# EAGLE design DistributionBoard (EAGLE 9.2.2)

## Sheet 1 of 3
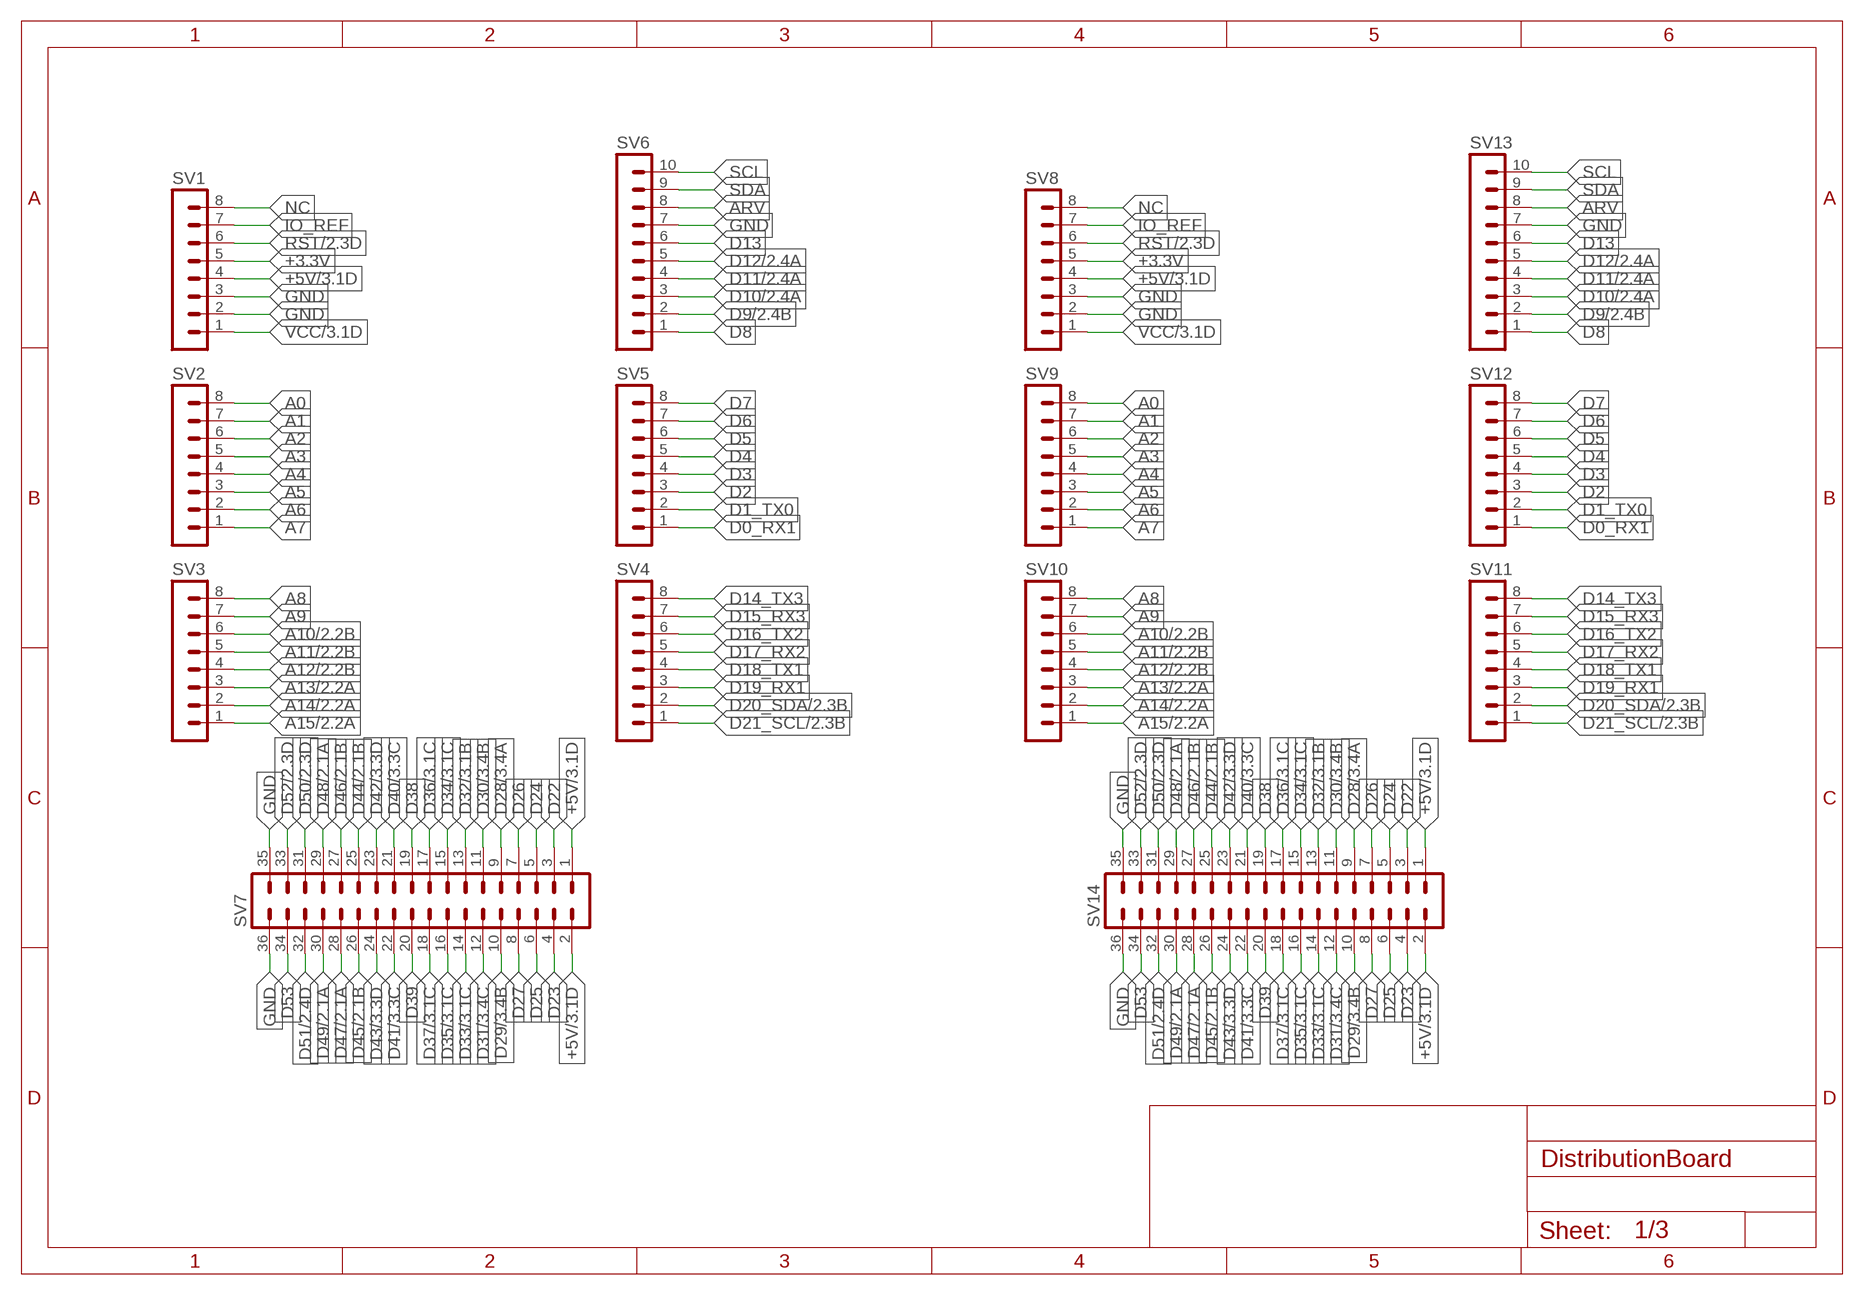
[diagram p0: schematic, sheet 1]

### Parts
SV1  MA08-1  [MA08-1]
SV2  MA08-1  [MA08-1]
SV3  MA08-1  [MA08-1]
SV4  MA08-1  [MA08-1]
SV5  MA08-1  [MA08-1]
SV6  MA10-1  [MA10-1]
SV7  MA18-2  [MA18-2]
SV8  MA08-1  [MA08-1]
SV9  MA08-1  [MA08-1]
SV10  MA08-1  [MA08-1]
SV11  MA08-1  [MA08-1]
SV12  MA08-1  [MA08-1]
SV13  MA10-1  [MA10-1]
SV14  MA18-2  [MA18-2]

### Nets
+3.3V: SV1.5 SV8.5
+5V: SV1.4 SV7.1 SV7.2 SV8.4 SV14.1 SV14.2 ; also sheet 2,3
A0: SV2.8 SV9.8
A1: SV2.7 SV9.7
A2: SV2.6 SV9.6
A3: SV2.5 SV9.5
A4: SV2.4 SV9.4
A5: SV2.3 SV9.3
A6: SV2.2 SV9.2
A7: SV2.1 SV9.1
A8: SV3.8 SV10.8
A9: SV3.7 SV10.7
A10: SV3.6 SV10.6 ; also sheet 2
A11: SV3.5 SV10.5 ; also sheet 2
A12: SV3.4 SV10.4 ; also sheet 2
A13: SV3.3 SV10.3 ; also sheet 2
A14: SV3.2 SV10.2 ; also sheet 2
A15: SV3.1 SV10.1 ; also sheet 2
ARV: SV6.8 SV13.8
D0_RX1: SV5.1 SV12.1
D1_TX0: SV5.2 SV12.2
D2: SV5.3 SV12.3
D3: SV5.4 SV12.4
D4: SV5.5 SV12.5
D5: SV5.6 SV12.6
D6: SV5.7 SV12.7
D7: SV5.8 SV12.8
D8: SV6.1 SV13.1
D9: SV6.2 SV13.2 ; also sheet 2
D10: SV6.3 SV13.3 ; also sheet 2
D11: SV6.4 SV13.4 ; also sheet 2
D12: SV6.5 SV13.5 ; also sheet 2
D13: SV6.6 SV13.6
D14_TX3: SV4.8 SV11.8
D15_RX3: SV4.7 SV11.7
D16_TX2: SV4.6 SV11.6
D17_RX2: SV4.5 SV11.5
D18_TX1: SV4.4 SV11.4
D19_RX1: SV4.3 SV11.3
D20_SDA: SV4.2 SV11.2 ; also sheet 2
D21_SCL: SV4.1 SV11.1 ; also sheet 2
D22: SV7.3 SV14.3
D23: SV7.4 SV14.4
D24: SV7.5 SV14.5
D25: SV7.6 SV14.6
D26: SV7.7 SV14.7
D27: SV7.8 SV14.8
D28: SV7.9 SV14.9 ; also sheet 3
D29: SV7.10 SV14.10 ; also sheet 3
D30: SV7.11 SV14.11 ; also sheet 3
D31: SV7.12 SV14.12 ; also sheet 3
D32: SV7.13 SV14.13 ; also sheet 3
D33: SV7.14 SV14.14 ; also sheet 3
D34: SV7.15 SV14.15 ; also sheet 3
D35: SV7.16 SV14.16 ; also sheet 3
D36: SV7.17 SV14.17 ; also sheet 3
D37: SV7.18 SV14.18 ; also sheet 3
D38: SV7.19 SV14.19
D39: SV7.20 SV14.20
D40: SV7.21 SV14.21 ; also sheet 3
D41: SV7.22 SV14.22 ; also sheet 3
D42: SV7.23 SV14.23 ; also sheet 3
D43: SV7.24 SV14.24 ; also sheet 3
D44: SV7.25 SV14.25 ; also sheet 2
D45: SV7.26 SV14.26 ; also sheet 2
D46: SV7.27 SV14.27 ; also sheet 2
D47: SV7.28 SV14.28 ; also sheet 2
D48: SV7.29 SV14.29 ; also sheet 2
D49: SV7.30 SV14.30 ; also sheet 2
D50: SV7.31 SV14.31 ; also sheet 2
D51: SV7.32 SV14.32 ; also sheet 2
D52: SV7.33 SV14.33 ; also sheet 2
D53: SV7.34 SV14.34
GND: SV1.2 SV1.3 SV6.7 SV7.35 SV7.36 SV8.2 SV8.3 SV13.7 SV14.35 SV14.36 ; also sheet 2,3
IO_REF: SV1.7 SV8.7
NC: SV1.8 SV8.8
RST: SV1.6 SV8.6 ; also sheet 2,3
SCL: SV6.10 SV13.10
SDA: SV6.9 SV13.9
VCC: SV1.1 SV8.1 ; also sheet 2,3

## Sheet 2 of 3
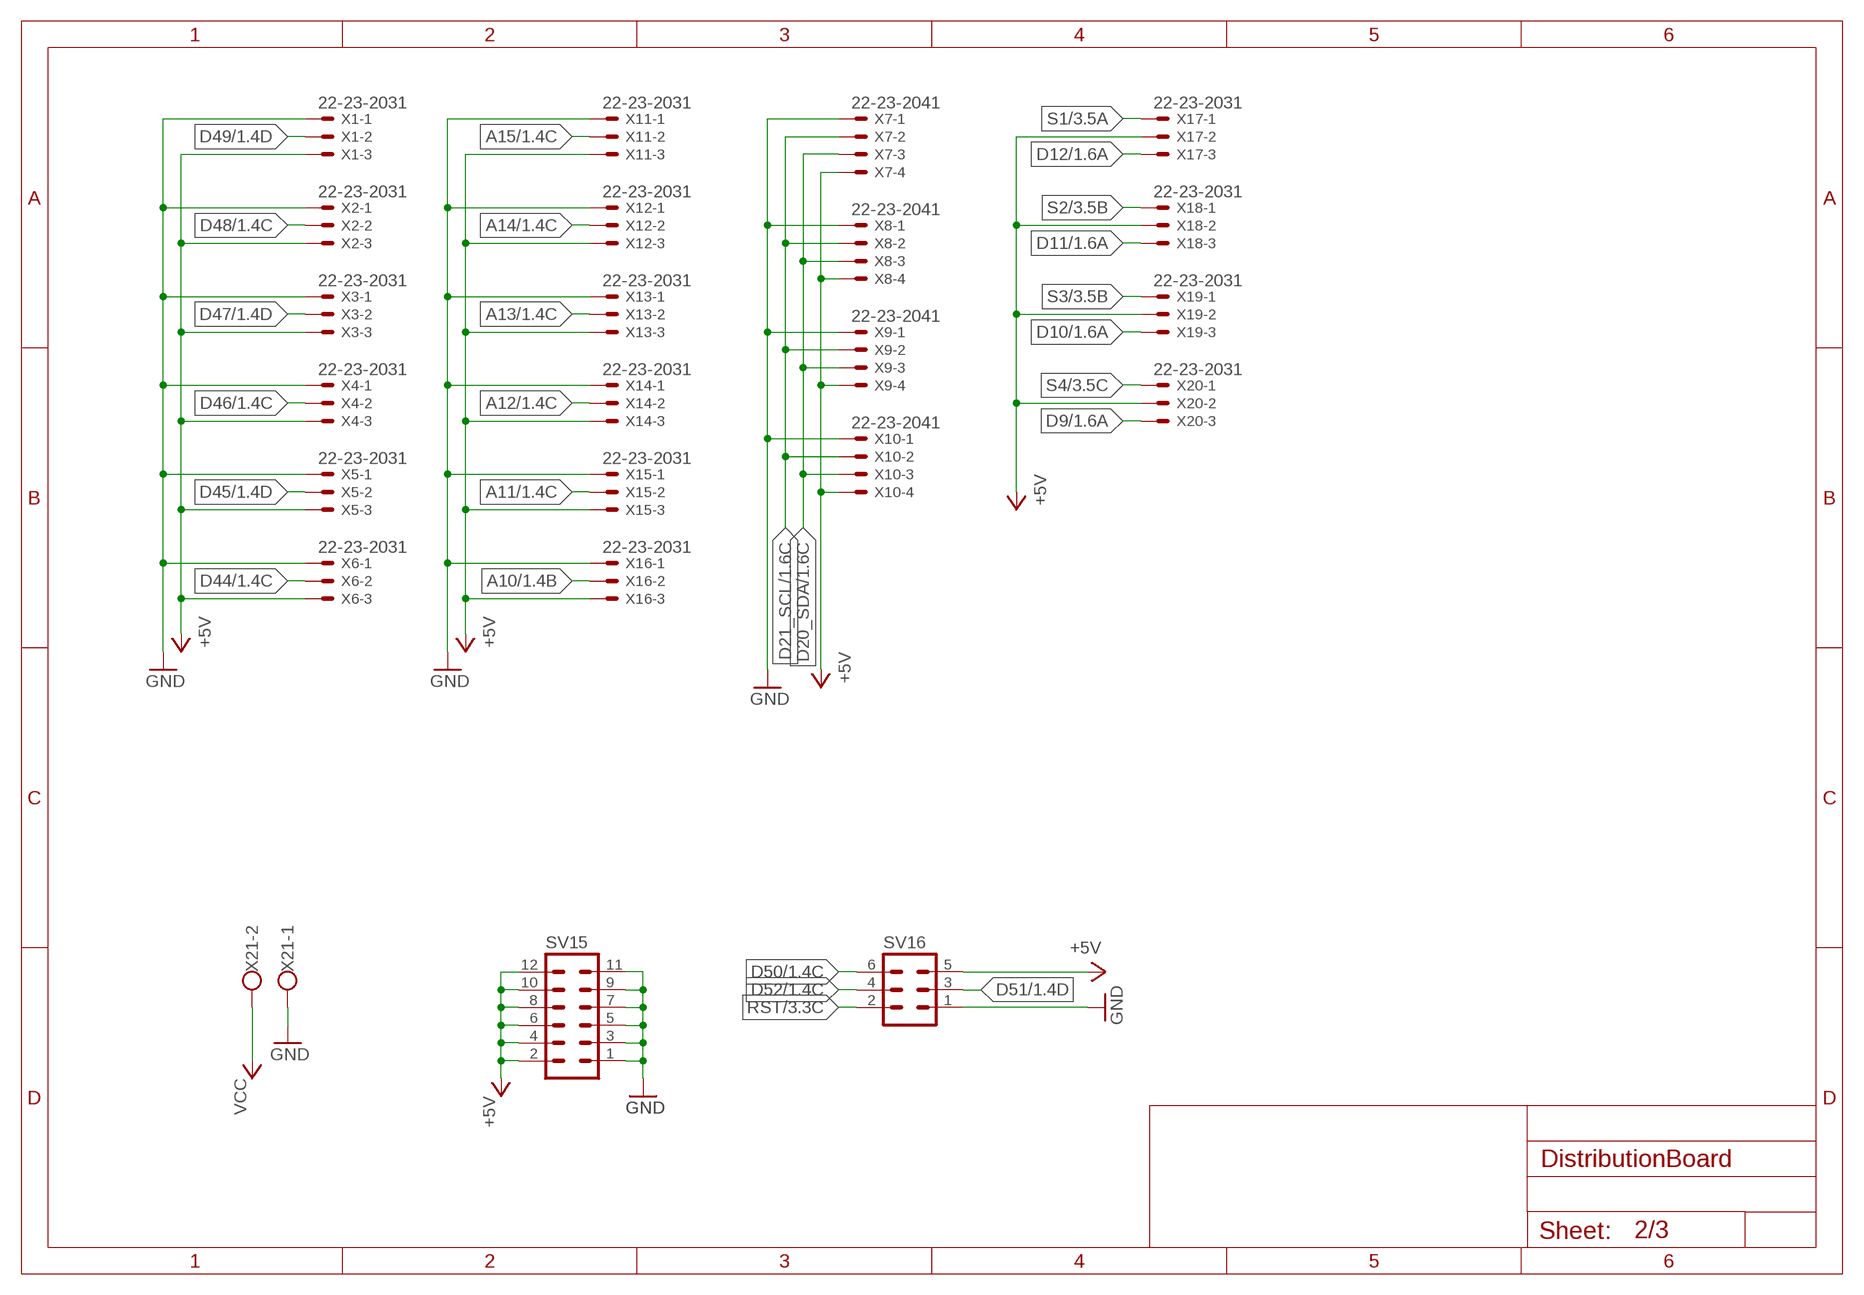
[diagram p1: schematic, sheet 2]

### Parts
SV15  MA06-2  [MA06-2]
SV16  MA03-2  [MA03-2]
X1  22-23-2031  [22-23-2031]
X2  22-23-2031  [22-23-2031]
X3  22-23-2031  [22-23-2031]
X4  22-23-2031  [22-23-2031]
X5  22-23-2031  [22-23-2031]
X6  22-23-2031  [22-23-2031]
X7  22-23-2041  [22-23-2041]
X8  22-23-2041  [22-23-2041]
X9  22-23-2041  [22-23-2041]
X10  22-23-2041  [22-23-2041]
X11  22-23-2031  [22-23-2031]
X12  22-23-2031  [22-23-2031]
X13  22-23-2031  [22-23-2031]
X14  22-23-2031  [22-23-2031]
X15  22-23-2031  [22-23-2031]
X16  22-23-2031  [22-23-2031]
X17  22-23-2031  [22-23-2031]
X18  22-23-2031  [22-23-2031]
X19  22-23-2031  [22-23-2031]
X20  22-23-2031  [22-23-2031]
X21  W237-102  [W237-102]

### Nets
+5V: SV15.2 SV15.4 SV15.6 SV15.8 SV15.10 SV15.12 SV16.5 X1.3 X2.3 X3.3 X4.3 X5.3 X6.3 X7.4 X8.4 X9.4 X10.4 X11.3 X12.3 X13.3 X14.3 X15.3 X16.3 X17.2 X18.2 X19.2 X20.2 ; also sheet 1,3
A10: X16.2 ; also sheet 1
A11: X15.2 ; also sheet 1
A12: X14.2 ; also sheet 1
A13: X13.2 ; also sheet 1
A14: X12.2 ; also sheet 1
A15: X11.2 ; also sheet 1
D9: X20.3 ; also sheet 1
D10: X19.3 ; also sheet 1
D11: X18.3 ; also sheet 1
D12: X17.3 ; also sheet 1
D20_SDA: X7.3 X8.3 X9.3 X10.3 ; also sheet 1
D21_SCL: X7.2 X8.2 X9.2 X10.2 ; also sheet 1
D44: X6.2 ; also sheet 1
D45: X5.2 ; also sheet 1
D46: X4.2 ; also sheet 1
D47: X3.2 ; also sheet 1
D48: X2.2 ; also sheet 1
D49: X1.2 ; also sheet 1
D50: SV16.6 ; also sheet 1
D51: SV16.3 ; also sheet 1
D52: SV16.4 ; also sheet 1
GND: SV15.1 SV15.3 SV15.5 SV15.7 SV15.9 SV15.11 SV16.1 X1.1 X2.1 X3.1 X4.1 X5.1 X6.1 X7.1 X8.1 X9.1 X10.1 X11.1 X12.1 X13.1 X14.1 X15.1 X16.1 X21.1 ; also sheet 1,3
RST: SV16.2 ; also sheet 1,3
S1: X17.1 ; also sheet 3
S2: X18.1 ; also sheet 3
S3: X19.1 ; also sheet 3
S4: X20.1 ; also sheet 3
VCC: X21.2 ; also sheet 1,3

## Sheet 3 of 3
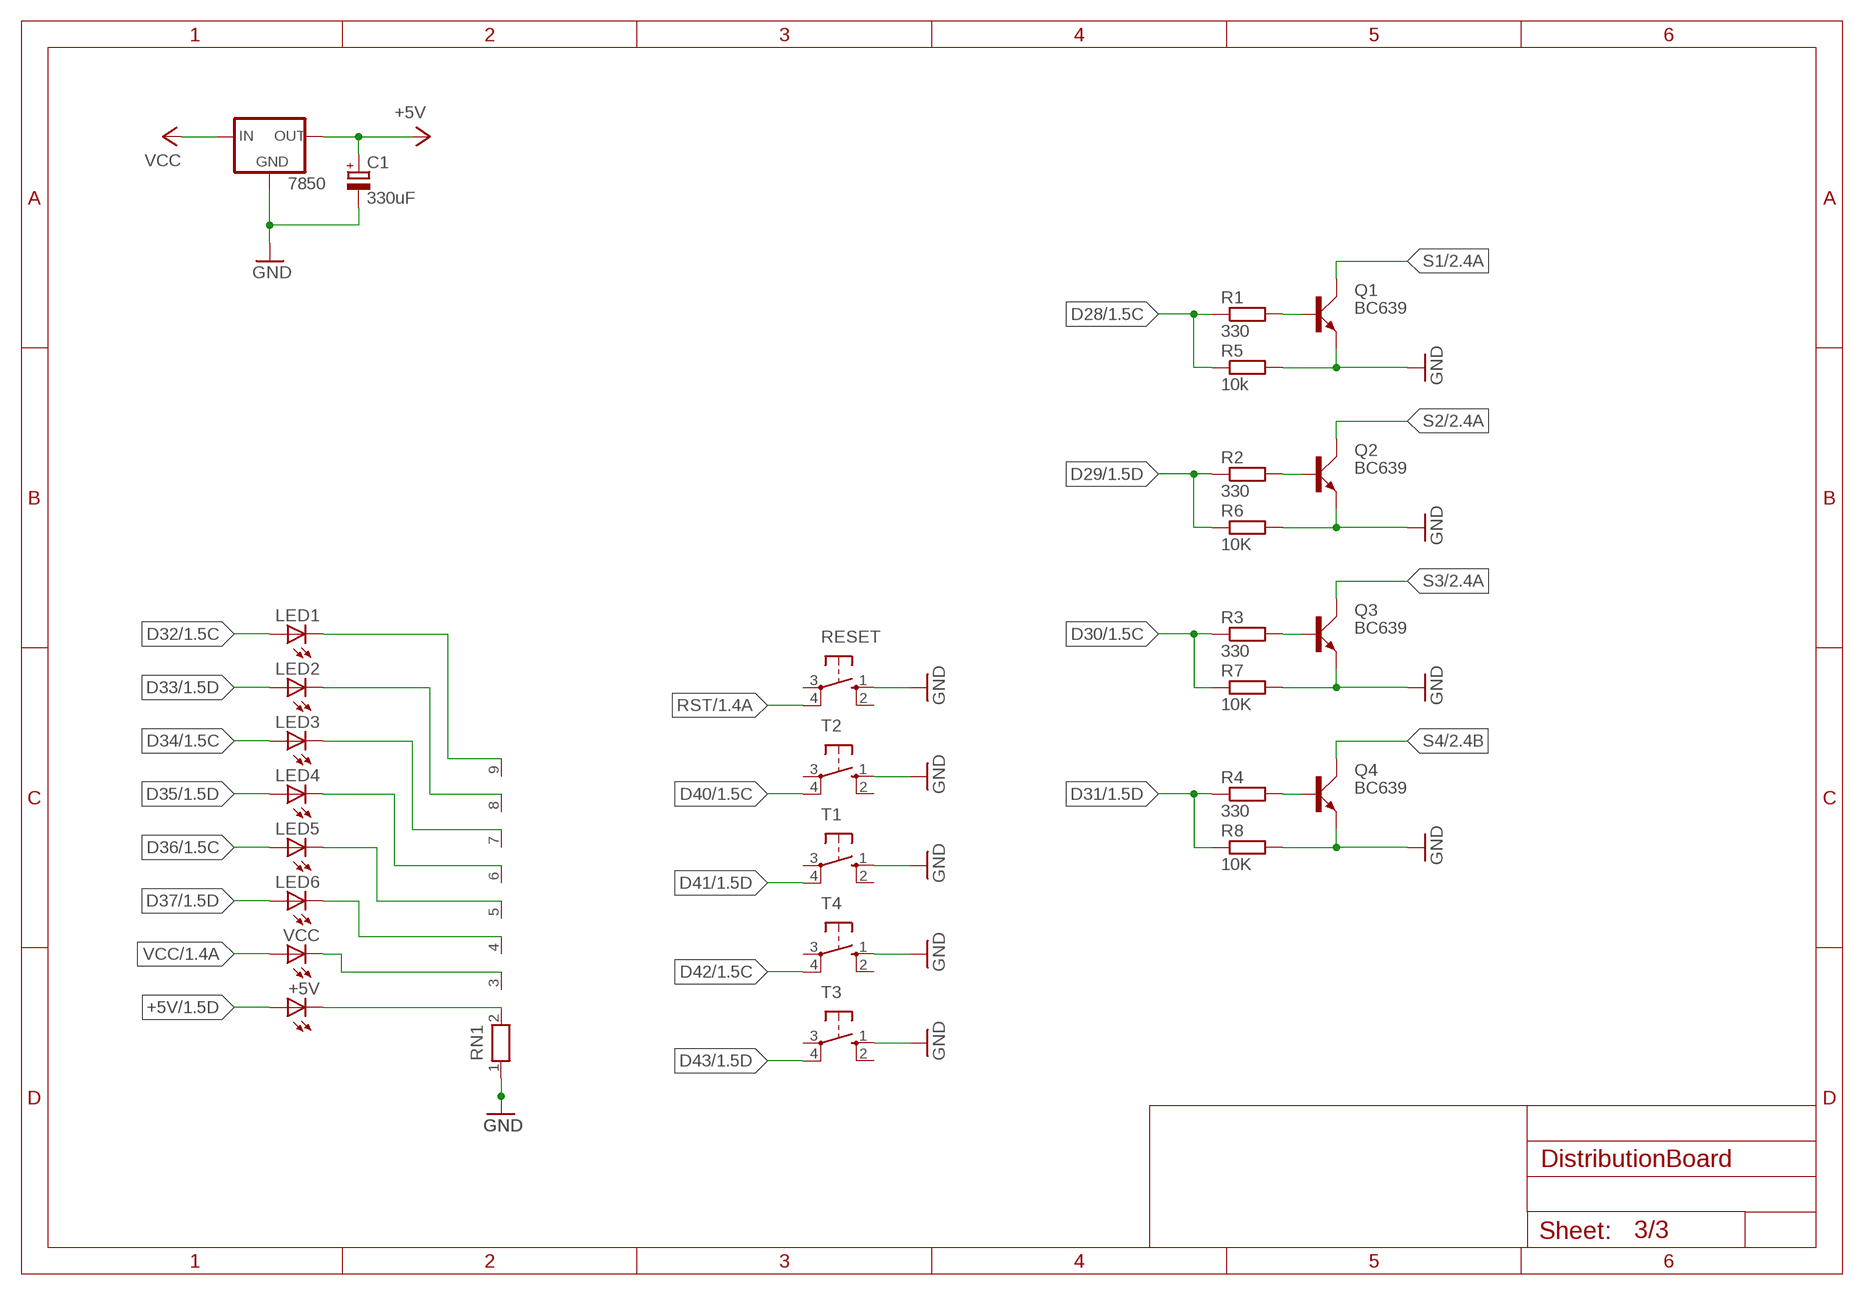
[diagram p2: schematic, sheet 3]

### Parts
7850  78XXS  [78XXS]
+5V  LED3MM  [LED3MM]
C1  330uF  CPOL-EUE3.5-8  [E3,5-8]
LED1  LED3MM  [LED3MM]
LED2  LED3MM  [LED3MM]
LED3  LED3MM  [LED3MM]
LED4  LED3MM  [LED3MM]
LED5  LED3MM  [LED3MM]
LED6  LED3MM  [LED3MM]
Q1  BC639  [SOT54D]
Q2  BC639  [SOT54D]
Q3  BC639  [SOT54D]
Q4  BC639  [SOT54D]
R1  330  R-EU_M1206  [M1206]
R2  330  R-EU_M1206  [M1206]
R3  330  R-EU_M1206  [M1206]
R4  330  R-EU_M1206  [M1206]
R5  10k  R-EU_M1206  [M1206]
R6  10K  R-EU_M1206  [M1206]
R7  10K  R-EU_M1206  [M1206]
R8  10K  R-EU_M1206  [M1206]
RESET  10-XX  [B3F-10XX]
RN1  RN08  [RN-9]
T1  10-XX  [B3F-10XX]
T2  10-XX  [B3F-10XX]
T3  10-XX  [B3F-10XX]
T4  10-XX  [B3F-10XX]
VCC  LED3MM  [LED3MM]

### Nets
+5V: 7850.OUT +5V.A C1.+ ; also sheet 1,2
D28: R1.1 R5.1 ; also sheet 1
D29: R2.1 R6.1 ; also sheet 1
D30: R3.1 R7.1 ; also sheet 1
D31: R4.1 R8.1 ; also sheet 1
D32: LED1.A ; also sheet 1
D33: LED2.A ; also sheet 1
D34: LED3.A ; also sheet 1
D35: LED4.A ; also sheet 1
D36: LED5.A ; also sheet 1
D37: LED6.A ; also sheet 1
D40: T2.4(P1) ; also sheet 1
D41: T1.4(P1) ; also sheet 1
D42: T4.4(P1) ; also sheet 1
D43: T3.4(P1) ; also sheet 1
GND: 7850.GND C1.- Q1.E Q2.E Q3.E Q4.E R5.2 R6.2 R7.2 R8.2 RESET.1(S) RN1.1 T1.1(S) T2.1(S) T3.1(S) T4.1(S) ; also sheet 1,2
N$1: +5V.K(C) RN1.2
N$2: RN1.3 VCC.K(C)
N$3: LED6.K(C) RN1.4
N$4: LED5.K(C) RN1.5
N$5: LED4.K(C) RN1.6
N$6: LED3.K(C) RN1.7
N$7: LED2.K(C) RN1.8
N$8: LED1.K(C) RN1.9
N$9: Q4.B R4.2
N$10: Q3.B R3.2
N$11: Q2.B R2.2
N$12: Q1.B R1.2
RST: RESET.4(P1) ; also sheet 1,2
S1: Q1.C ; also sheet 2
S2: Q2.C ; also sheet 2
S3: Q3.C ; also sheet 2
S4: Q4.C ; also sheet 2
VCC: 7850.IN VCC.A ; also sheet 1,2
Unconnected: RESET.2(S1) RESET.3(P) T1.2(S1) T1.3(P) T2.2(S1) T2.3(P) T3.2(S1) T3.3(P) T4.2(S1) T4.3(P)

## Library data of the parts
7850 = v-reg:78XXS: VOLTAGE REGULATOR
+5V LED1-LED6 VCC = led:LED: LED OSRAM: - CHIPLED LG R971, LG N971, LY N971, LG Q971, LY Q971, LO R971, LY R971 LH N974, LH R974 LS Q976, LO Q976, LY Q976 LO Q996 - Hyper CHIPLED LW Q18S LB Q993, LB Q99A, LB R99A - SideLED LS A670, LO A670, LY A670, LG A670, LP A670 LB A673, LV A673, LT A673, LW A673 LH A674 LY A675 LS A676, LA A676, LO A676, LY A676, LW A676 LS A679, LY A679, LG A679 - Hyper Micro SIDELED® LS Y876, LA Y876, LO Y876, LY Y876 LT Y87S - SmartLED LW L88C, LW L88S LB L89C, LB L89S, LG L890 LS L89K, LO L89K, LY L89K LS L896, LA L896, LO L896, LY L896 - TOPLED LS T670, LO T670, LY T670, LG T670, LP T670 LSG T670, LSP T670, LSY T670, LOP T670, LYG T670 LG T671, LOG T671, LSG T671 LB T673, LV T673, LT T673, LW T673 LH T674 LS T676, LA T676, LO T676, LY T676, LB T676, LH T676, LSB T676, LW T676 LB T67C, LV T67C, LT T67C, LS T67K, LO T67K, LY T67K, LW E67C LS E67B, LA E67B, LO E67B, LY E67B, LB E67C, LV E67C, LT E67C LW T67C LS T679, LY T679, LG T679 LS T770, LO T770, LY T770, LG T770, LP T770 LB T773, LV T773, LT T773, LW T773 LH T774 LS E675, LA E675, LY E675, LS T675 LS T776, LA T776, LO T776, LY T776, LB T776 LHGB T686 LT T68C, LB T68C - Hyper Mini TOPLED® LB M676 - Mini TOPLED Santana® LG M470 LS M47K, LO M47K, LY M47K Source: http://www.osram.convergy.de LUXEON: - LUMILED® LXK2-PW12-R00, LXK2-PW12-S00, LXK2-PW14-U00, LXK2-PW14-V00 LXK2-PM12-R00, LXK2-PM12-S00, LXK2-PM14-U00 LXK2-PE12-Q00, LXK2-PE12-R00, LXK2-PE12-S00, LXK2-PE14-T00, LXK2-PE14-U00 LXK2-PB12-K00, LXK2-PB12-L00, LXK2-PB12-M00, LXK2-PB14-N00, LXK2-PB14-P00, LXK2-PB14-Q00 LXK2-PR12-L00, LXK2-PR12-M00, LXK2-PR14-Q00, LXK2-PR14-R00 LXK2-PD12-Q00, LXK2-PD12-R00, LXK2-PD12-S00 LXK2-PH12-R00, LXK2-PH12-S00 LXK2-PL12-P00, LXK2-PL12-Q00, LXK2-PL12-R00 Source: www.luxeon.com KINGBRIGHT: KA-3528ASYC Source: www.kingbright.com
C1 = rcl:CPOL-EU: POLARIZED CAPACITOR, European symbol; SPICEPREFIX: C
Q1-Q4 = transistor-small-signal:BC639: NPN TRANSISTOR
R1-R8 = rcl:R-EU_: RESISTOR, European symbol; SPICEPREFIX: R
RESET T1-T4 = switch-omron:10-XX: OMRON SWITCH; MPN: B3F-1000; OC_FARNELL: 176432; OC_NEWARK: 36M3542
RN1 = resistor-net:RN08: RESISTOR NETWORK; OC_FARNELL: unknown; OC_NEWARK: unknown
SV1-SV5 SV8-SV12 = con-lstb:MA08-1: PIN HEADER; OC_FARNELL: unknown; OC_NEWARK: unknown
SV6 SV13 = con-lstb:MA10-1: PIN HEADER; OC_FARNELL: unknown; OC_NEWARK: unknown
SV7 SV14 = con-lstb:MA18-2: PIN HEADER; OC_FARNELL: unknown; OC_NEWARK: unknown
SV15 = con-lstb:MA06-2: PIN HEADER; OC_FARNELL: unknown; OC_NEWARK: unknown
SV16 = con-lstb:MA03-2: PIN HEADER; OC_FARNELL: unknown; OC_NEWARK: unknown
X1-X6 X11-X20 = con-molex:22-23-2031: .100" (2.54mm) Center Header - 3 Pin; MF: MOLEX; MPN: 22-23-2031; OC_FARNELL: 1462950; OC_NEWARK: 30C0862
X7-X10 = con-molex:22-23-2041: .100" (2.54mm) Center Header - 4 Pin; MF: MOLEX; MPN: 22-23-2041; OC_FARNELL: 1462920; OC_NEWARK: 38C0355
X21 = con-wago-500:W237-102: WAGO SCREW CLAMP; MPN: 237-102; OC_FARNELL: unknown; OC_NEWARK: 70K9898

## Board
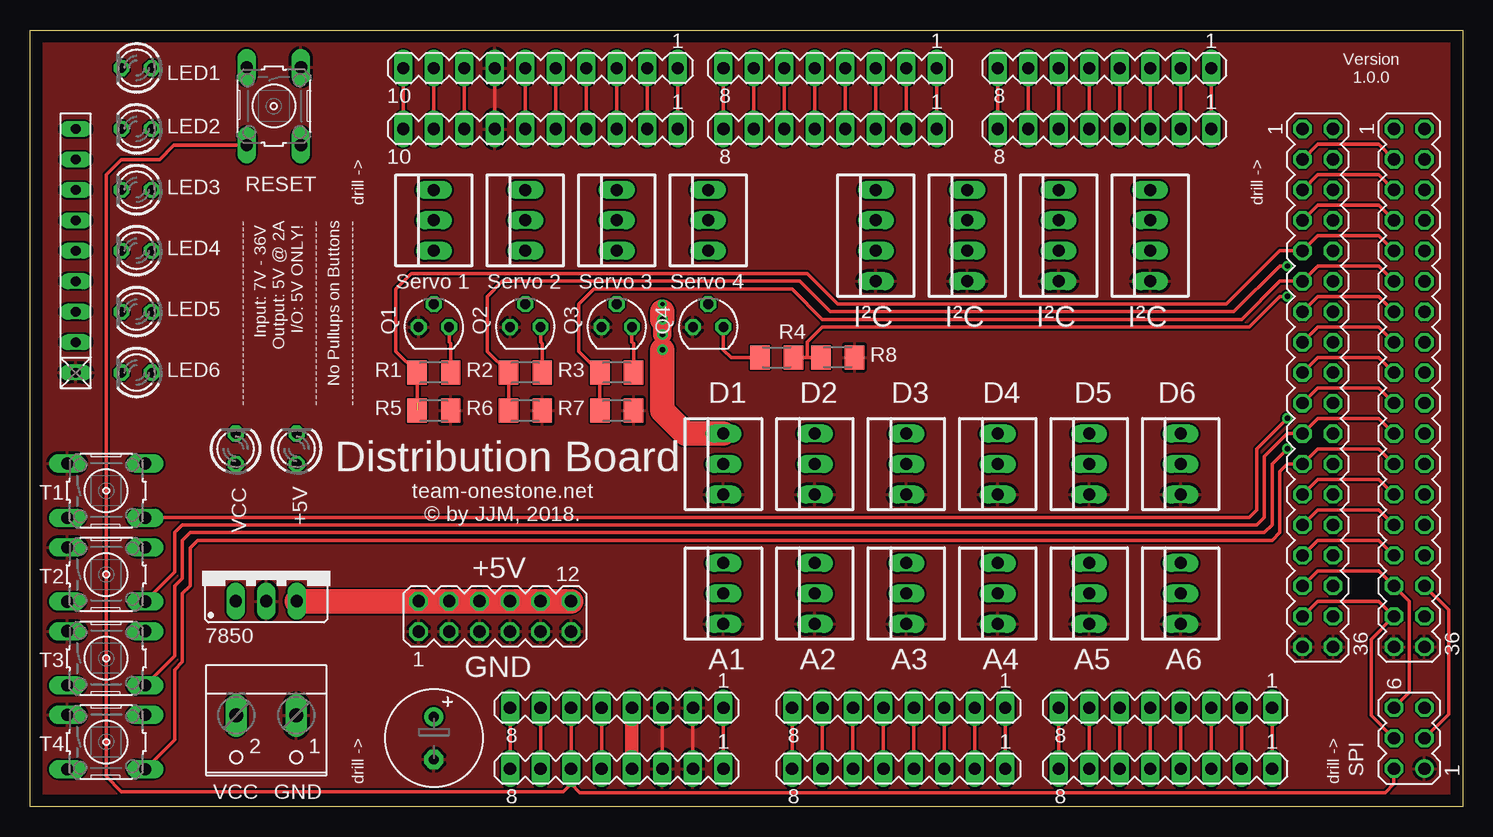
[diagram p3: board, top side]
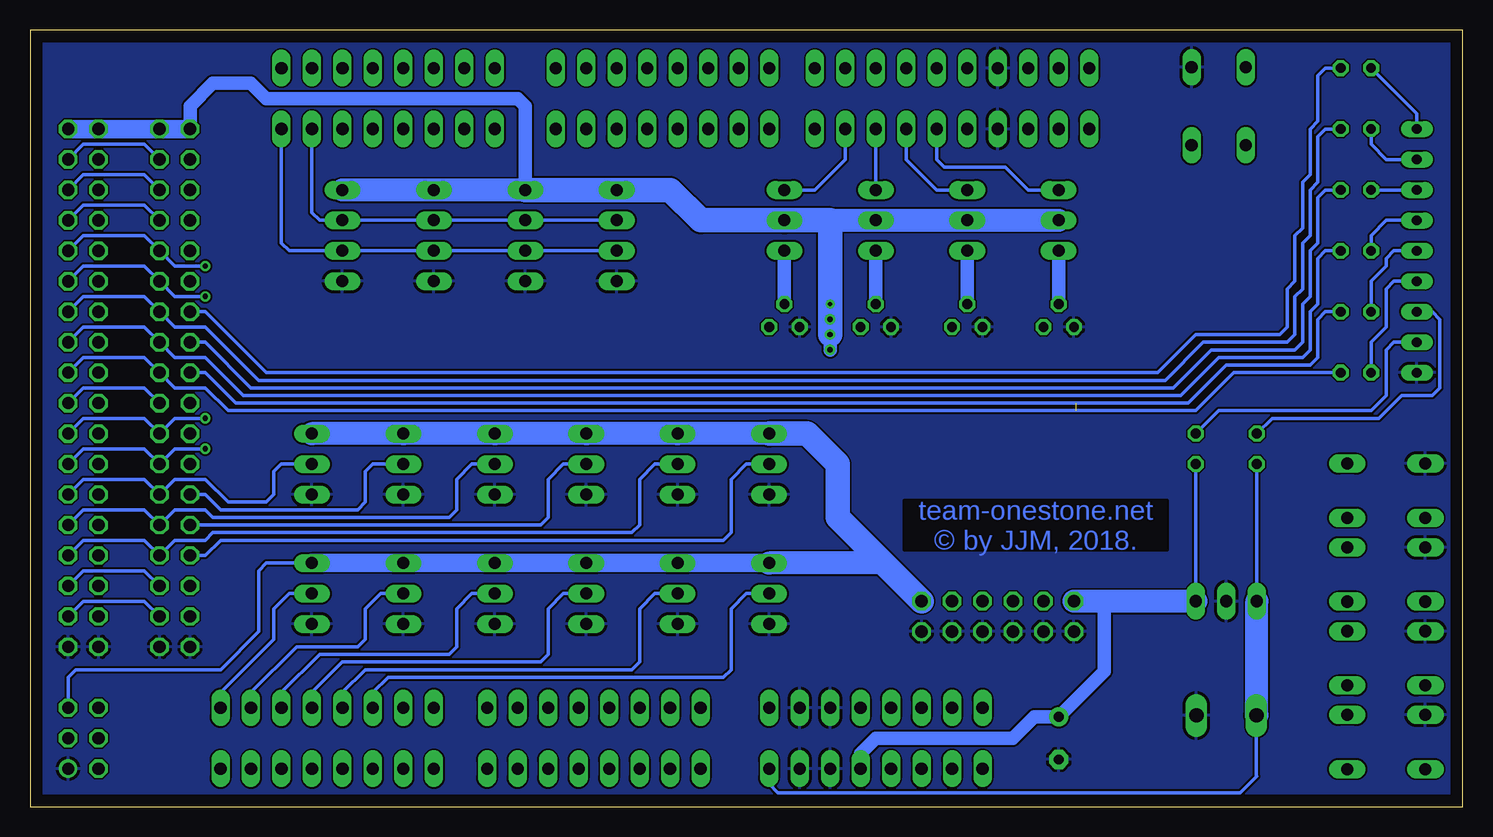
[diagram p4: board, bottom side, seen from below]

Size 119.38 x 64.77 mm. Coordinates in mm from the lower left corner, seen from the top.
Outline: 0,0 0,64.77 119.38,64.77 119.38,0 0,0
Copper layers (1*16): Top 0.035mm / dielectric 1.5mm / Bottom 0.035mm
Design rules "default": minimum track width 6mil, minimum drill 0.35mm, track to track 6mil, track to pad 6mil, pad to pad 6mil, via to via 6mil, smd to smd 6mil, copper to edge 40mil, drill to drill 6mil, minimum pad ring 10mil, minimum via ring 8mil, stop-mask expansion 4mil, vias tented up to drill 0mil, thermal gap 10mil

### Footprints (pad centres in the part's own frame; a part is rotated, then mirrored left to right if it is on the bottom)
78XXS = drill 1.016 long: GND 0,-2.54; IN -2.54,-2.54; OUT 2.54,-2.54
LED3MM = drill 0.813 octagon: A -1.27,0; K 1.27,0
E3,5-8 = drill 0.813 pad 1.6: + -1.778,0 | drill 0.813 pad 1.6 octagon: - 1.778,0
SOT54D = drill 0.813 octagon: B 1.27,0; C 0,1.905; E -1.27,0
M1206 = smd 1.6 x 2: 1 -1.4,0; 2 1.4,0
B3F-10XX = drill 1.016 long: 1 -3.251,2.261; 2 3.251,2.261; 3 -3.251,-2.261; 4 3.251,-2.261
RN-9 = drill 0.813 long: 1 -10.16,0; 2 -7.62,0; 3 -5.08,0; 4 -2.54,0; 5 0,0; 6 2.54,0; 7 5.08,0; 8 7.62,0; 9 10.16,0
MA08-1 = drill 1.016 long: 1 -8.89,0; 2 -6.35,0; 3 -3.81,0; 4 -1.27,0; 5 1.27,0; 6 3.81,0; 7 6.35,0; 8 8.89,0
MA10-1 = drill 1.016 long: 1 -11.43,0; 2 -8.89,0; 3 -6.35,0; 4 -3.81,0; 5 -1.27,0; 6 1.27,0; 7 3.81,0; 8 6.35,0; 9 8.89,0; 10 11.43,0
MA18-2 = drill 1.016 octagon: 1 -21.59,-1.27; 2 -21.59,1.27; 3 -19.05,-1.27; 4 -19.05,1.27; 5 -16.51,-1.27; 6 -16.51,1.27; 7 -13.97,-1.27; 8 -13.97,1.27; 9 -11.43,-1.27; 10 -11.43,1.27; 11 -8.89,-1.27; 12 -8.89,1.27; 13 -6.35,-1.27; 14 -6.35,1.27; 15 -3.81,-1.27; 16 -3.81,1.27; 17 -1.27,-1.27; 18 -1.27,1.27; 19 1.27,-1.27; 20 1.27,1.27; 21 3.81,-1.27; 22 3.81,1.27; 23 6.35,-1.27; 24 6.35,1.27; 25 8.89,-1.27; 26 8.89,1.27; 27 11.43,-1.27; 28 11.43,1.27; 29 13.97,-1.27; 30 13.97,1.27; 31 16.51,-1.27; 32 16.51,1.27; 33 19.05,-1.27; 34 19.05,1.27; 35 21.59,-1.27; 36 21.59,1.27
MA06-2 = drill 1.016 octagon: 1 -6.35,-1.27; 2 -6.35,1.27; 3 -3.81,-1.27; 4 -3.81,1.27; 5 -1.27,-1.27; 6 -1.27,1.27; 7 1.27,-1.27; 8 1.27,1.27; 9 3.81,-1.27; 10 3.81,1.27; 11 6.35,-1.27; 12 6.35,1.27
MA03-2 = drill 1.016: 1 -2.54,-1.27 | drill 1.016 octagon: 2 -2.54,1.27; 3 0,-1.27; 4 0,1.27; 5 2.54,-1.27; 6 2.54,1.27
22-23-2031 = drill 1 long: 1 -2.54,0; 2 0,0; 3 2.54,0
22-23-2041 = drill 1 long: 1 -3.81,0; 2 -1.27,0; 3 1.27,0; 4 3.81,0
W237-102 = drill 1.194 long: 1 -2.5,-1.27; 2 2.5,-1.27

### Placement (x,y rotation side)
7850  19.68,19.68 0 top
+5V  22.23,29.84 90 top
C1  33.66,5.71 270 top
LED1  8.89,61.59 180 top
LED2  8.89,56.52 180 top
LED3  8.89,51.44 180 top
LED4  8.89,46.35 180 top
LED5  8.89,41.27 180 top
LED6  8.89,36.2 180 top
Q1  33.66,40.01 0 top
Q2  41.27,40.01 0 top
Q3  48.9,40.01 0 top
Q4  56.52,40.01 0 top
R1  33.66,36.2 0 top
R2  41.27,36.2 0 top
R3  48.9,36.2 0 top
R4  62.23,37.47 180 top
R5  33.66,33.02 0 top
R6  41.27,33.02 0 top
R7  48.9,33.02 0 top
R8  67.31,37.47 0 top
RESET  20.32,58.42 270 top
RN1  3.81,46.35 90 top
SV1  48.9,8.26 180 top
SV2  72.39,8.26 180 top
SV3  94.61,8.26 180 top
SV4  89.53,56.52 180 top
SV5  66.67,56.52 180 top
SV6  42.55,56.52 180 top
SV7  107.31,34.92 270 top
SV8  48.9,3.17 180 top
SV9  72.39,3.17 180 top
SV10  94.61,3.17 180 top
SV11  89.53,61.59 180 top
SV12  66.67,61.59 180 top
SV13  42.55,61.59 180 top
SV14  114.94,34.92 270 top
SV15  38.73,15.88 0 top
SV16  114.94,5.71 90 top
T1  6.35,26.35 0 top
T2  6.35,19.37 0 top
T3  6.35,12.38 0 top
T4  6.35,5.4 0 top
VCC  17.14,29.84 90 top
X1  65.41,28.57 90 top
X2  57.78,28.57 90 top
X3  80.64,28.57 90 top
X4  73.03,28.57 90 top
X5  95.89,28.57 90 top
X6  88.27,28.57 90 top
X7  93.34,47.62 90 top
X8  85.72,47.62 90 top
X9  78.11,47.62 90 top
X10  70.48,47.62 90 top
X11  95.89,17.78 90 top
X12  88.27,17.78 90 top
X13  80.64,17.78 90 top
X14  73.03,17.78 90 top
X15  65.41,17.78 90 top
X16  57.78,17.78 90 top
X17  33.66,48.9 90 top
X18  41.27,48.9 90 top
X19  48.9,48.9 90 top
X20  56.52,48.9 90 top
X21  19.68,6.35 180 top

### Tracks (layer width: path | path; a pad name or v marks a point on that pad's centre or on a via)
+3.3V
  Top 0.305: SV1.5 SV8.5
+5V  (via drill 0.35, 0.45)
  Top 1.143: SV1.4 SV8.4
  Top 1.524: v52.7,39.37 v52.7,40.64
  Top 2.032: 7850.OUT SV15.2 SV15.4 SV15.6 SV15.8 SV15.10 SV15.12 | X2.3 54.61,31.11 52.7,33.02 v52.7,38.1 | v52.7,40.64 52.7,41.27
  Bottom 0.305: +5V.A 7850.OUT | SV16.5 116.2,10.79 115.57,11.43 103.5,11.43 100.33,14.61 100.33,19.68 99.69,20.32 X11.3
  Bottom 1.143: X9.4 78.11,58.42 78.74,59.05 99.69,59.05 100.97,60.33 104.14,60.33 106.05,58.42 SV7.1 | 29.84,17.14 29.84,11.3 C1.+ 35.69,7.49 37.47,5.71 48.9,5.71 50.16,4.45 SV8.4 | v52.7,39.37 v52.7,38.1
  Bottom 1.524: X16.3 X15.3 X14.3 X13.3 X12.3 X11.3 | SV7.1 SV7.2 SV14.1 SV14.2
  Bottom 1.905: 48.26,20.32 X16.3 | X2.3 X1.3 X4.3 X3.3 X6.3 X5.3 | X9.4 X8.4 X7.4 | 52.7,48.9 X19.2 X18.2 X17.2 | 7850.OUT 29.84,17.14 SV15.2
  Bottom 2.032: SV15.12 48.26,20.32 52.07,24.13 52.07,28.57 54.61,31.11 X2.3 | v52.7,39.37 52.7,40.31 | v52.7,40.64 v52.7,41.91 52.7,48.9 X20.2 63.5,48.9 66.04,51.44 X10.4 X9.4
A0
  Top 0.305: SV2.8 SV9.8
A1
  Top 0.305: SV2.7 SV9.7
A2
  Top 0.305: SV2.6 SV9.6
A3
  Top 0.305: SV2.5 SV9.5
A4
  Top 0.305: SV2.4 SV9.4
A5
  Top 0.305: SV2.3 SV9.3
A6
  Top 0.305: SV2.2 SV9.2
A7
  Top 0.305: SV2.1 SV9.1
A8
  Top 0.305: SV3.8 SV10.8
A9
  Top 0.305: SV3.7 SV10.7
A10
  Top 0.305: SV3.6 SV10.6
  Bottom 0.305: X16.2 59.69,17.78 60.96,16.51 60.96,11.43 61.59,10.79 89.53,10.79 90.81,9.53 SV3.6
A11
  Top 0.305: SV3.5 SV10.5
  Bottom 0.305: X15.2 67.31,17.78 68.58,16.51 68.58,12.06 69.22,11.43 91.44,11.43 93.34,9.53 SV3.5
A12
  Top 0.305: SV3.4 SV10.4
  Bottom 0.305: X14.2 74.93,17.78 76.2,16.51 76.2,12.7 76.83,12.06 93.34,12.06 95.89,9.53 SV3.4
A13
  Top 0.305: SV3.3 SV10.3
  Bottom 0.305: X13.2 82.55,17.78 83.82,16.51 83.82,13.34 84.45,12.7 95.25,12.7 98.42,9.53 SV3.3
A14
  Top 0.305: SV3.2 SV10.2
  Bottom 0.305: X12.2 90.17,17.78 91.44,16.51 91.44,13.97 92.08,13.34 97.16,13.34 100.97,9.53 SV3.2
A15
  Top 0.305: SV3.1 SV10.1
  Bottom 0.305: X11.2 97.79,17.78 99.06,16.51 99.06,13.97 103.5,9.53 SV3.1
ARV
  Top 0.305: SV6.8 SV13.8
D0_RX1
  Top 0.305: SV5.1 SV12.1
D1_TX0
  Top 0.305: SV5.2 SV12.2
D2
  Top 0.305: SV5.3 SV12.3
D3
  Top 0.305: SV5.4 SV12.4
D4
  Top 0.305: SV5.5 SV12.5
D5
  Top 0.305: SV5.6 SV12.6
D6
  Top 0.305: SV5.7 SV12.7
D7
  Top 0.305: SV5.8 SV12.8
D8
  Top 0.305: SV6.1 SV13.1
D9
  Top 0.305: SV6.2 SV13.2
  Bottom 0.305: X20.3 53.98,51.44 51.44,53.98 SV6.2
D10
  Top 0.305: SV6.3 SV13.3
  Bottom 0.305: X19.3 SV6.3
D11
  Top 0.305: SV6.4 SV13.4
  Bottom 0.305: X18.3 43.81,51.44 46.35,53.98 SV6.4
D12
  Top 0.305: SV6.5 SV13.5
  Bottom 0.305: X17.3 36.2,51.44 38.1,53.34 43.18,53.34 43.81,53.98 SV6.5
D13
  Top 0.305: SV6.6 SV13.6
D14_TX3
  Top 0.305: SV4.8 SV11.8
D15_RX3
  Top 0.305: SV4.7 SV11.7
D16_TX2
  Top 0.305: SV4.6 SV11.6
D17_RX2
  Top 0.305: SV4.5 SV11.5
D18_TX1
  Top 0.305: SV4.4 SV11.4
D19_RX1
  Top 0.305: SV4.3 SV11.3
D20_SDA
  Top 0.305: SV4.2 SV11.2
  Bottom 0.305: X10.3 X9.3 X8.3 X7.3 95.25,48.9 95.89,49.53 SV4.2
D21_SCL
  Top 0.305: SV4.1 SV11.1
  Bottom 0.305: X10.2 X9.2 X8.2 X7.2 97.79,46.35 98.42,46.99 SV4.1
D22
  Top 0.305: SV7.3 107.31,55.24 112.39,55.24 SV14.3
D23
  Bottom 0.305: SV7.4 109.86,55.24 114.94,55.24 SV14.4
D24
  Top 0.305: SV7.5 107.31,52.7 112.39,52.7 SV14.5
D25
  Bottom 0.305: SV7.6 109.86,52.7 114.94,52.7 SV14.6
D26
  Top 0.305: SV7.7 107.31,50.16 112.39,50.16 SV14.7
D27
  Bottom 0.305: SV7.8 109.86,50.16 114.94,50.16 SV14.8
D28  (1 unrouted)
  Top 0.305: SV14.9 112.39,47.62 107.31,47.62 SV7.9 104.14,46.35 99.69,41.91 67.31,41.91 64.77,44.45 31.75,44.45 30.48,43.18 30.48,37.97 R1.1 32.26,33.66
D29  (via drill 0.45)
  Top 0.305: R6.1 R2.1 38.1,37.97 38.1,42.55 39.37,43.81 64.14,43.81 66.67,41.27 100.33,41.27 104.14,45.09 v104.78,45.09
  Bottom 0.305: SV14.10 114.94,47.62 109.86,47.62 SV7.10 107.31,45.09 v104.78,45.09
D30
  Top 0.305: SV14.11 112.39,45.09 107.31,45.09 SV7.11 104.14,43.81 100.97,40.64 66.04,40.64 63.5,43.18 46.99,43.18 45.72,41.91 45.72,37.97 R3.1 R7.1
D31  (via drill 0.45)
  Top 0.305: R4.1 64.77,37.47 | 64.77,37.47 R8.1 | v104.78,42.55 104.14,42.55 101.6,40.01 66.04,40.01 64.77,38.73 64.77,37.47
  Bottom 0.305: SV14.12 114.94,45.09 109.86,45.09 SV7.12 107.31,42.55 v104.78,42.55
D32
  Top 0.305: SV7.13 107.31,42.55 112.39,42.55 SV14.13
  Bottom 0.305: SV7.13 104.78,41.27 99.69,36.2 25.4,36.2 22.23,39.37 15.24,39.37 14.61,40.01 14.61,43.18 13.97,43.81 13.97,47.62 13.34,48.26 13.34,52.07 12.7,52.7 12.7,56.52 12.06,57.15 12.06,60.96 11.43,61.59 LED1.A
D33
  Bottom 0.305: SV14.14 114.94,42.55 109.86,42.55 SV7.14 107.31,40.01 104.78,40.01 100.33,35.56 24.77,35.56 21.59,38.73 14.61,38.73 13.97,39.37 13.97,42.55 13.34,43.18 13.34,46.99 12.7,47.62 12.7,51.44 12.06,52.07 12.06,55.88 11.43,56.52 LED2.A
D34
  Top 0.305: SV7.15 107.31,40.01 112.39,40.01 SV14.15
  Bottom 0.305: SV7.15 104.78,38.73 100.97,34.92 24.13,34.92 20.95,38.1 13.97,38.1 13.34,38.73 13.34,41.91 12.7,42.55 12.7,46.35 12.06,46.99 12.06,50.8 11.43,51.44 LED3.A
D35
  Bottom 0.305: SV14.16 114.94,40.01 109.86,40.01 SV7.16 107.31,37.47 104.78,37.47 101.6,34.29 23.5,34.29 20.32,37.47 13.34,37.47 12.7,38.1 12.7,41.27 12.06,41.91 12.06,45.72 11.43,46.35 LED4.A
D36
  Top 0.305: SV7.17 107.31,37.47 112.39,37.47 SV14.17
  Bottom 0.305: SV7.17 104.78,36.2 102.23,33.66 22.86,33.66 19.68,36.83 12.7,36.83 12.06,37.47 12.06,40.64 11.43,41.27 LED5.A
D37
  Bottom 0.305: SV14.18 114.94,37.47 109.86,37.47 SV7.18 107.31,34.92 104.78,34.92 102.87,33.02 22.23,33.02 19.05,36.2 LED6.A
D38
  Top 0.305: SV7.19 107.31,34.92 112.39,34.92 SV14.19
D39
  Bottom 0.305: SV7.20 109.86,34.92 114.94,34.92 SV14.20
D40
  Top 0.305: SV14.21 112.39,32.38 107.31,32.38 SV7.21 104.78,31.11 102.87,29.21 102.87,24.13 102.23,23.5 12.7,23.5 12.06,22.86 12.06,19.57 T2.4
D41  (via drill 0.45)
  Top 0.305: v104.78,32.38 102.23,29.84 102.23,24.77 101.6,24.13 9.64,24.13 T1.4
  Bottom 0.305: SV14.22 114.94,32.38 109.86,32.38 SV7.22 107.31,32.38 v104.78,32.38
D42
  Top 0.305: SV14.23 112.39,29.84 107.31,29.84 SV7.23 104.78,28.57 104.14,27.94 104.14,22.86 103.5,22.23 13.97,22.23 13.34,21.59 13.34,18.41 12.7,17.78 12.7,12.06 12.06,11.43 12.06,5.6 T4.4
D43  (via drill 0.45)
  Top 0.305: v104.78,29.84 103.5,28.57 103.5,23.5 102.87,22.86 13.34,22.86 12.7,22.23 12.7,19.05 12.06,18.41 12.06,12.59 T3.4
  Bottom 0.305: SV14.24 114.94,29.84 109.86,29.84 SV7.24 107.31,29.84 v104.78,29.84
D44
  Top 0.305: SV7.25 107.31,27.3 112.39,27.3 SV14.25
  Bottom 0.305: SV7.25 104.78,26.04 103.5,24.77 92.08,24.77 91.44,25.4 91.44,27.94 90.81,28.57 X6.2
D45
  Bottom 0.305: SV14.26 114.94,27.3 109.86,27.3 SV7.26 107.31,27.3 104.78,27.3 102.87,25.4 99.69,25.4 99.06,26.04 99.06,27.94 98.42,28.57 X5.2
D46
  Top 0.305: SV7.27 107.31,24.77 112.39,24.77 SV14.27
  Bottom 0.305: X4.2 74.93,28.57 76.2,27.3 76.2,24.13 76.83,23.5 SV7.27
D47
  Bottom 0.305: SV14.28 114.94,24.77 109.86,24.77 SV7.28 107.31,24.77 104.78,24.77 104.14,24.13 84.45,24.13 83.82,24.77 83.82,27.3 82.55,28.57 X3.2
D48
  Top 0.305: SV7.29 107.31,22.23 112.39,22.23 SV14.29
  Bottom 0.305: SV7.29 104.78,20.95 103.5,22.23 61.59,22.23 60.96,22.86 60.96,27.3 59.69,28.57 X2.2
D49
  Bottom 0.305: SV14.30 114.94,22.23 109.86,22.23 SV7.30 107.31,22.23 104.78,22.23 104.14,22.86 69.22,22.86 68.58,23.5 68.58,27.3 67.31,28.57 X1.2
D50
  Top 0.305: SV7.31 107.31,19.68 112.39,19.68 SV14.31 114.94,17.14 114.94,9.53 SV16.6
D51
  Top 0.305: SV14.32 118.21,16.41 118.21,7.72 SV16.3
  Bottom 0.305: SV7.32 109.86,19.68 114.94,19.68 SV14.32
D52
  Top 0.305: SV7.33 107.31,17.14 112.39,17.14 SV14.33 111.76,13.97 111.76,7.62 SV16.4
D53
  Bottom 0.305: SV7.34 109.86,17.14 114.94,17.14 SV14.34
GND
  Top 0.305: SV1.3 SV8.3 | SV1.2 SV8.2 | SV6.7 SV13.7
  pour Bottom: 0,0 119.38,0 119.38,64.77 0,64.77
  pour Top: 0,0 119.38,0 119.38,64.77 0,64.77
IO_REF
  Top 0.305: SV1.7 SV8.7
N$1
  Bottom 0.305: RN1.2 5.71,38.73 6.35,38.1 6.35,34.29 7.62,33.02 20.32,33.02 +5V.K
N$2
  Bottom 0.305: VCC.K 15.88,32.38 6.99,32.38 5.08,34.29 2.54,34.29 1.91,34.92 1.91,40.64 2.54,41.27 RN1.3
N$3
  Bottom 0.305: RN1.4 5.71,43.81 6.35,43.18 6.35,40.01 7.62,38.73 LED6.K
N$4
  Bottom 0.305: LED5.K 7.62,43.81 6.35,45.09 6.35,45.72 5.71,46.35 RN1.5
N$5
  Bottom 0.305: RN1.6 6.35,48.9 7.62,47.62 LED4.K
N$6
  Bottom 0.305: LED3.K RN1.7
N$7
  Bottom 0.305: RN1.8 6.35,53.98 7.62,55.24 LED2.K
N$8
  Bottom 0.305: RN1.9 3.81,57.78 LED1.K
N$9
  Top 0.305: R4.2 58.42,37.47 57.78,38.1 Q4.B
N$10
  Top 0.305: R3.2 50.3,38.6 50.16,38.73 Q3.B
N$11
  Top 0.305: R2.2 42.67,38.6 42.55,38.73 Q2.B
N$12
  Top 0.305: R1.2 35.05,38.6 34.92,38.73 Q1.B
NC
  Top 0.305: SV1.8 SV8.8
RST
  Top 0.305: SV1.6 SV8.6 45.09,1.91 | SV16.2 113.67,1.91 112.93,1.17 45.82,1.17 45.09,1.91 | 45.09,1.91 44.45,1.27 7.62,1.27 6.35,2.54 6.35,52.7 7.62,53.98 10.79,53.98 11.99,55.17 RESET.4
S1
  Bottom 1.143: X17.1 Q1.C
S2
  Bottom 1.143: X18.1 Q2.C
S3
  Bottom 1.143: X19.1 Q3.C
S4
  Bottom 1.143: X20.1 Q4.C
SCL
  Top 0.305: SV6.10 SV13.10
SDA
  Top 0.305: SV6.9 SV13.9
VCC
  Top 0.305: SV1.1 SV8.1
  Bottom 0.305: 7850.IN VCC.A | SV8.1 57.78,1.91 57.05,1.17 18.52,1.17 17.14,2.54 17.18,2.58 X21.2
  Bottom 1.905: X21.2 17.14,7.66 7850.IN

### Text on the board
Bottom: team-onestone.net / © by JJM, 2018.
tPlace: Servo 1 | Servo 2 | Servo 3 | Servo 4 | I²C | I²C | I²C | I²C | D1 | D2 | D3 | D4 | D5 | D6 | Distribution Board | team-onestone.net / © by JJM, 2018. | +5V | GND | A1 | A2 | A3 | A4 | A5 | A6 | SPI | VCC | GND
tNames: Version / 1.0.0 | drill -> | drill -> | ------------------------------- / Input: 7V - 36V / Output: 5V @ 2A / I/O: 5V ONLY! / ------------------------------- / No Pullups on Buttons / ------------------------------- | drill -> | drill ->